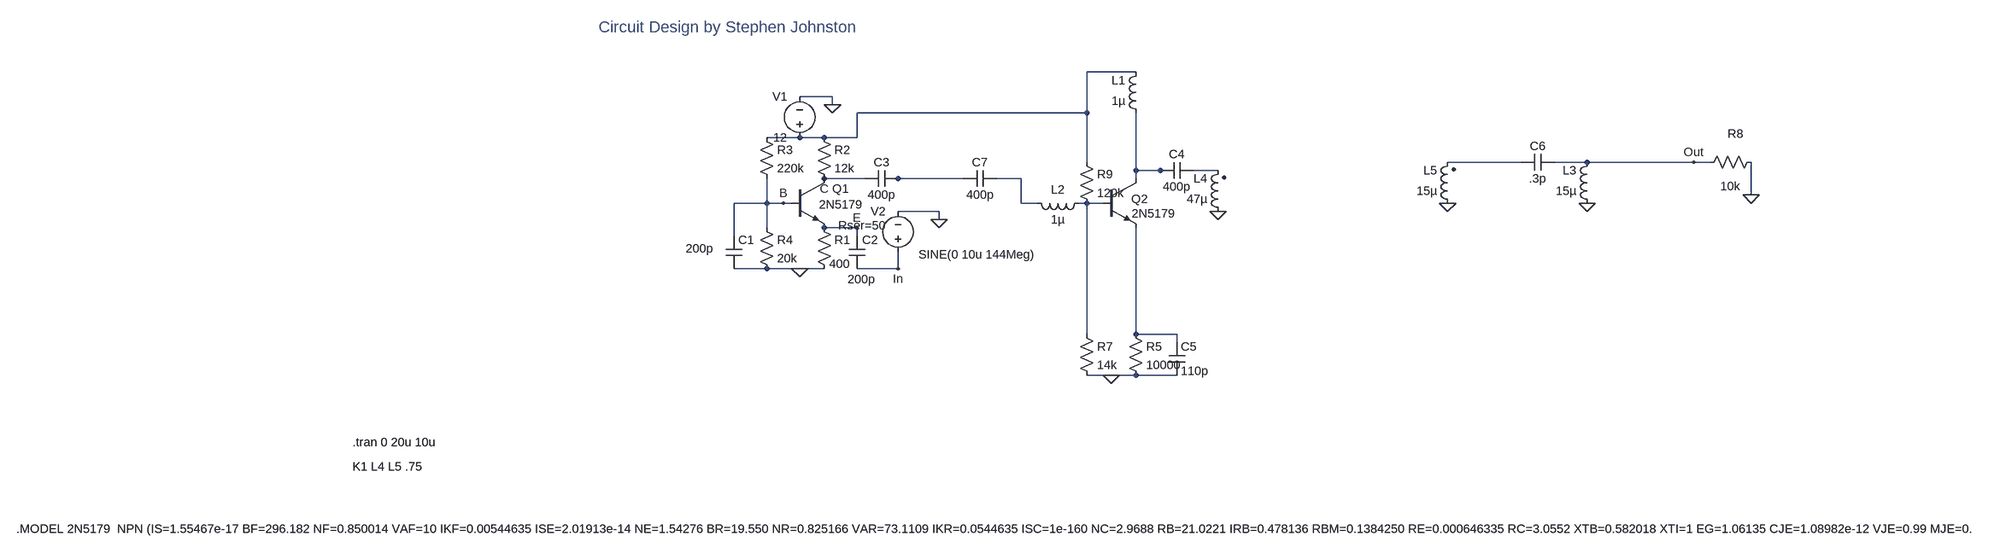
[diagram p0: schematic Commonbase1.asc]
Commonbase1.asc, the LTspice schematic file:
Version 4
SHEET 1 6588 784
WIRE 800 -336 704 -336
WIRE 208 -288 144 -288
WIRE 208 -272 208 -288
WIRE 704 -256 704 -336
WIRE 704 -256 256 -256
WIRE 144 -208 80 -208
WIRE 192 -208 144 -208
WIRE 256 -208 256 -256
WIRE 256 -208 192 -208
WIRE 704 -160 704 -256
WIRE 1552 -160 1408 -160
WIRE 1680 -160 1616 -160
WIRE 1888 -160 1680 -160
WIRE 1920 -160 1888 -160
WIRE 800 -144 800 -256
WIRE 848 -144 800 -144
WIRE 864 -144 848 -144
WIRE 960 -144 912 -144
WIRE 272 -128 192 -128
WIRE 336 -128 320 -128
WIRE 464 -128 336 -128
WIRE 576 -128 528 -128
WIRE 800 -128 800 -144
WIRE 2000 -96 2000 -160
WIRE 80 -80 80 -128
WIRE 80 -80 16 -80
WIRE 112 -80 80 -80
WIRE 128 -80 112 -80
WIRE 576 -80 576 -128
WIRE 608 -80 576 -80
WIRE 704 -80 688 -80
WIRE 736 -80 704 -80
WIRE 416 -64 336 -64
WIRE 416 -48 416 -64
WIRE 80 -32 80 -80
WIRE 256 -32 192 -32
WIRE 16 -16 16 -80
WIRE 256 -16 256 -32
WIRE 80 48 16 48
WIRE 144 48 80 48
WIRE 192 48 144 48
WIRE 336 48 336 16
WIRE 336 48 256 48
WIRE 704 176 704 -80
WIRE 800 176 800 -32
WIRE 880 176 800 176
WIRE 880 192 880 176
WIRE 752 256 704 256
WIRE 800 256 752 256
WIRE 880 256 800 256
FLAG 144 48 0
FLAG 208 -272 0
FLAG 416 -48 0
FLAG 112 -80 B
FLAG 192 -128 C
FLAG 256 -32 E
FLAG 752 256 0
FLAG 2000 -96 0
FLAG 336 48 In
FLAG 1888 -160 Out
FLAG 1680 -80 0
FLAG 960 -64 0
FLAG 1408 -80 0
SYMBOL npn 128 -128 R0
WINDOW 3 54 51 Left 2
WINDOW 0 80 20 Left 2
SYMATTR Value 2N5179
SYMATTR InstName Q1
SYMBOL res 176 -48 R0
WINDOW 3 26 87 Left 2
SYMATTR Value 400
SYMATTR InstName R1
SYMBOL res 176 -224 R0
SYMATTR InstName R2
SYMATTR Value 12k
SYMBOL res 64 -224 R0
SYMATTR InstName R3
SYMATTR Value 220k
SYMBOL res 64 -48 R0
SYMATTR InstName R4
SYMATTR Value 20k
SYMBOL cap 0 -16 R0
WINDOW 3 -78 25 Left 2
SYMATTR InstName C1
SYMATTR Value 200p
SYMBOL cap 240 -16 R0
WINDOW 0 26 8 Left 2
WINDOW 3 -2 85 Left 2
SYMATTR InstName C2
SYMATTR Value 200p
SYMBOL voltage 144 -192 R180
WINDOW 0 24 96 Left 2
WINDOW 3 24 16 Left 2
WINDOW 123 0 0 Left 2
WINDOW 39 0 0 Left 2
SYMATTR InstName V1
SYMATTR Value 12
SYMBOL voltage 336 32 R180
WINDOW 0 24 96 Left 2
WINDOW 3 -267 12 Left 2
WINDOW 123 0 0 Left 2
WINDOW 39 24 68 Left 2
SYMATTR InstName V2
SYMATTR Value SINE(0 10u 144Meg)
SYMATTR SpiceLine Rser=50
SYMBOL cap 336 -144 R90
WINDOW 0 0 32 VBottom 2
WINDOW 3 32 32 VTop 2
SYMATTR InstName C3
SYMATTR Value 400p
SYMBOL npn 736 -128 R0
WINDOW 0 55 40 Left 2
SYMATTR InstName Q2
SYMATTR Value 2N5179
SYMBOL res 784 160 R0
SYMATTR InstName R5
SYMATTR Value 10000
SYMBOL res 2016 -176 R90
WINDOW 0 -24 46 VBottom 2
WINDOW 3 47 56 VTop 2
SYMATTR InstName R8
SYMATTR Value 10k
SYMBOL res 688 160 R0
SYMATTR InstName R7
SYMATTR Value 14k
SYMBOL res 688 -176 R0
SYMATTR InstName R9
SYMATTR Value 120k
SYMBOL ind 816 -240 R180
WINDOW 0 36 80 Left 2
WINDOW 3 36 40 Left 2
SYMATTR InstName L1
SYMATTR Value 1µ
SYMBOL cap 864 192 R0
SYMATTR InstName C5
SYMATTR Value 110p
SYMBOL cap 1616 -176 R90
WINDOW 0 0 32 VBottom 2
WINDOW 3 32 32 VTop 2
SYMATTR InstName C6
SYMATTR Value .3p
SYMBOL ind 1696 -64 R180
WINDOW 0 36 80 Left 2
WINDOW 3 36 40 Left 2
SYMATTR InstName L3
SYMATTR Value 15µ
SYMBOL cap 528 -144 R90
WINDOW 0 0 32 VBottom 2
WINDOW 3 32 32 VTop 2
SYMATTR InstName C7
SYMATTR Value 400p
SYMBOL ind2 976 -48 R180
WINDOW 0 36 80 Left 2
WINDOW 3 36 40 Left 2
SYMATTR InstName L4
SYMATTR Value 47µ
SYMATTR Type ind
SYMATTR SpiceLine Rser=10
SYMBOL ind2 1424 -64 R180
WINDOW 0 36 80 Left 2
WINDOW 3 36 40 Left 2
SYMATTR InstName L5
SYMATTR Value 15µ
SYMATTR Type ind
SYMBOL cap 912 -160 R90
WINDOW 0 0 32 VBottom 2
WINDOW 3 32 32 VTop 2
SYMATTR InstName C4
SYMATTR Value 400p
SYMBOL ind 704 -96 R90
WINDOW 0 5 56 VBottom 2
WINDOW 3 32 56 VTop 2
SYMATTR InstName L2
SYMATTR Value 1µ
TEXT -728 440 Left 2 !.tran 0 20u 10u
TEXT -1384 768 Left 2 !.MODEL 2N5179  NPN (IS=1.55467e-17 BF=296.182 NF=0.850014 VAF=10 IKF=0.00544635 ISE=2.01913e-14 NE=1.54276 BR=19.550 NR=0.825166 VAR=73.1109 IKR=0.0544635 ISC=1e-160 NC=2.9688 RB=21.0221 IRB=0.478136 RBM=0.1384250 RE=0.000646335 RC=3.0552 XTB=0.582018 XTI=1 EG=1.06135 CJE=1.08982e-12 VJE=0.99 MJE=0.230 TF=2.15066e-11 XTF=1000 VTF=1.33967 ITF=0.0010 CJC=1.89423e-12 VJC=0.95 MJC=0.23 XCJC=0.4084790 FC=0.1 CJS=0 VJS=0.75 MJS=0.50 TR=1e-07 PTF=0 KF=0 AF=1)
TEXT -248 -424 Left 3 ;Circuit Design by Stephen Johnston
TEXT -728 488 Left 2 !K1 L4 L5 .75

The netlist it stands for:
* Commonbase1.asc
Q1 C B E 0 2N5179
R1 E 0 400
R2 N001 C 12k
R3 N001 B 220k
R4 B 0 20k
C1 B 0 200p
C2 E In 200p
V1 N001 0 12
V2 In 0 SINE(0 10u 144Meg) Rser=50
C3 N005 C 400p
Q2 N003 N007 N008 0 2N5179
R5 N008 0 10000
R8 0 Out 10k
R7 N007 0 14k
R9 N001 N007 120k
L1 N003 N001 1µ
C5 N008 0 110p
C6 Out N002 .3p
L3 0 Out 15µ
C7 N006 N005 400p
L4 0 N004 47µ Rser=10
L5 0 N002 15µ
C4 N004 N003 400p
L2 N007 N006 1µ
.model NPN NPN
.model PNP PNP
.lib standard.bjt
.tran 0 20u 10u
.MODEL 2N5179  NPN (IS=1.55467e-17 BF=296.182 NF=0.850014 VAF=10 IKF=0.00544635 ISE=2.01913e-14 NE=1.54276 BR=19.550 NR=0.825166 VAR=73.1109 IKR=0.0544635 ISC=1e-160 NC=2.9688 RB=21.0221 IRB=0.478136 RBM=0.1384250 RE=0.000646335 RC=3.0552 XTB=0.582018 XTI=1 EG=1.06135 CJE=1.08982e-12 VJE=0.99 MJE=0.230 TF=2.15066e-11 XTF=1000 VTF=1.33967 ITF=0.0010 CJC=1.89423e-12 VJC=0.95 MJC=0.23 XCJC=0.4084790 FC=0.1 CJS=0 VJS=0.75 MJS=0.50 TR=1e-07 PTF=0 KF=0 AF=1)
* Circuit Design by Stephen Johnston
K1 L4 L5 .75
.backanno
.end